# Altium schematic sheet UFP.SchDoc
size B; SheetNumber: 3; SheetTotal: 8
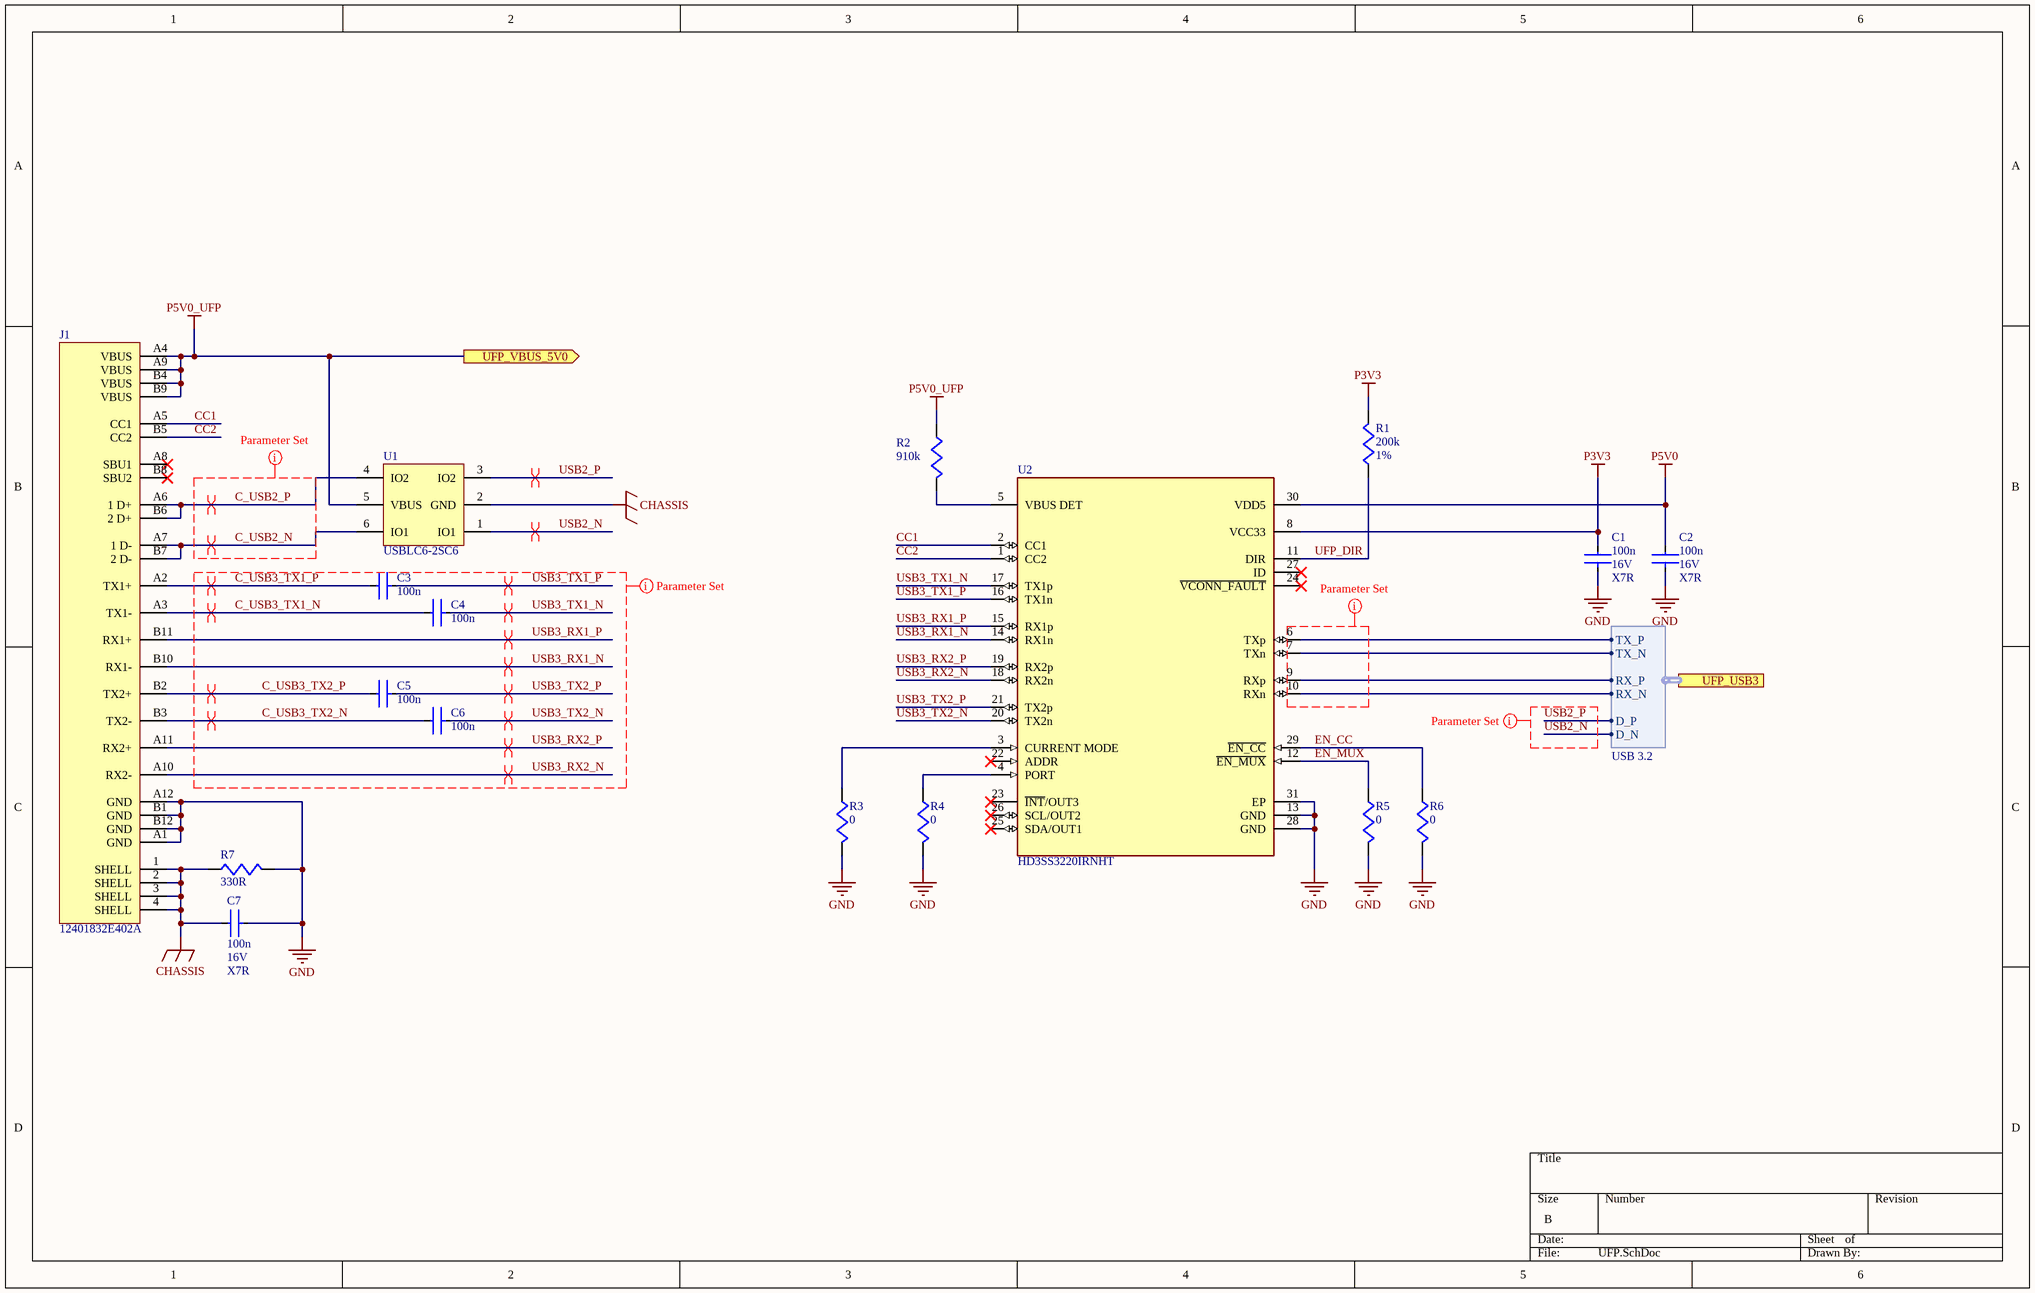
[diagram p0: UFP.SchDoc]

## Parts
C1  value 100n  Voltage: 16V  Dielectric: X7R  [CAPC1005X06N]  (hidden comment: 100nF 16V 0402)
C2  value 100n  Voltage: 16V  Dielectric: X7R  [CAPC1005X06N]  (hidden comment: 100nF 16V 0402)
C3  value 100n  [CAPC0603X03N]  (hidden comment: 100nF 10V 0201)
C4  value 100n  [CAPC0603X03N]  (hidden comment: 100nF 10V 0201)
C5  value 100n  [CAPC0603X03N]  (hidden comment: 100nF 10V 0201)
C6  value 100n  [CAPC0603X03N]  (hidden comment: 100nF 10V 0201)
C7  value 100n  Voltage: 16V  Dielectric: X7R  [CAPC1005X06N]  (hidden comment: 100nF 16V 0402)
J1  12401832E402A  [FP-12401832E402A-MFG]
R1  value 200k  Tolerance: 1%  [RESC1005X04M]  (hidden comment: 200k 1% 0402)
R2  value 910k  [RESC1005X04M]  (hidden comment: 910k 1% 0402)
R3  value 0  [RESC1508X05M]  (hidden comment: 0 Ohm 1% 0603)
R4  value 0  [RESC1508X05M]  (hidden comment: 0 Ohm 1% 0603)
R5  value 0  [RESC1508X05M]  (hidden comment: 0 Ohm 1% 0603)
R6  value 0  [RESC1508X05M]  (hidden comment: 0 Ohm 1% 0603)
R7  value 330R  [RESC1005X04M]  (hidden comment: 330R 1% 0402)
U1  USBLC6-2SC6  [SOT95P280X145-6N]
U2  HD3SS3220IRNHT  [FP-RNH0030A-MFG]

## Ports
UFP_USB3 (harness USB 3.2, see Main[1B], USB7206C[1D]), UFP_VBUS_5V0 (out, see Main[1B], USB7206C[1A])

## Harnesses
USB 3.2: D_N, D_P, TX_P, TX_N, RX_P, RX_N

## Nets
CHASSIS: C7.2 J1.1(SHELL) J1.2(SHELL) J1.3(SHELL) J1.4(SHELL) R7.1 U1.2(GND)
GND: C1.1 C2.1 C7.1 J1.A1(GND) J1.A12(GND) J1.B1(GND) J1.B12(GND) R3.2 R4.2 R5.2 R6.2 R7.2 U2.13(GND) U2.28(GND) U2.31(EP)
P3V3: C1.2 R1.2 U2.8(VCC33)
P5V0: C2.2 U2.30(VDD5)
P5V0_UFP: J1.A4(VBUS) J1.A9(VBUS) J1.B4(VBUS) J1.B9(VBUS) R2.1 U1.5(VBUS) ; port UFP_VBUS_5V0
C_USB2_N: J1.A7(1_D-) J1.B7(2_D-) U1.6(IO1)
C_USB2_P: J1.A6(1_D+) J1.B6(2_D+) U1.4(IO2)
C_USB3_TX1_N: C4.2 J1.A3(TX1-)
C_USB3_TX1_P: C3.2 J1.A2(TX1+)
C_USB3_TX2_N: C6.2 J1.B3(TX2-)
C_USB3_TX2_P: C5.2 J1.B2(TX2+)
CC1: J1.A5(CC1) U2.2(CC1)
CC2: J1.B5(CC2) U2.1(CC2)
EN_CC: R6.1 U2.29(~{EN_CC})
EN_MUX: R5.1 U2.12(~{EN_MUX})
UFP_DIR: R1.1 U2.11(DIR)
USB2_N: U1.1(IO1) ; port UFP_USB3.D_N
USB2_P: U1.3(IO2) ; port UFP_USB3.D_P
USB3_RX1_N: J1.B10(RX1-) U2.14(RX1n)
USB3_RX1_P: J1.B11(RX1+) U2.15(RX1p)
USB3_RX2_N: J1.A10(RX2-) U2.18(RX2n)
USB3_RX2_P: J1.A11(RX2+) U2.19(RX2p)
USB3_TX1_N: C4.1 U2.17(TX1p)
USB3_TX1_P: C3.1 U2.16(TX1n)
USB3_TX2_N: C6.1 U2.20(TX2n)
USB3_TX2_P: C5.1 U2.21(TX2p)
NetR2_2: R2.2 U2.5(VBUS_DET)
NetR3_1: R3.1 U2.3(CURRENT_MODE)
NetR4_1: R4.1 U2.4(PORT)
NetU2_6: U2.6(TXp) ; port UFP_USB3.TX_P
NetU2_7: U2.7(TXn) ; port UFP_USB3.TX_N
NetU2_9: U2.9(RXp) ; port UFP_USB3.RX_P
NetU2_10: U2.10(RXn) ; port UFP_USB3.RX_N

Not connected (* = marked no-connect by the designer): J1 A8(SBU1)* B8(SBU2)*; U2 22(ADDR)* 23(~{INT}/OUT3)* 24(~{VCONN_FAULT})* 25(SDA/OUT1)* 26(SCL/OUT2)* 27(ID)*

## Layout directives
differential pair; differential pair class DIFF90: C_USB2_N, C_USB2_P, C_USB3_TX1_N, C_USB3_TX1_P, C_USB3_TX2_N, C_USB3_TX2_P, USB2_N, USB2_P, USB3_RX1_N, USB3_RX1_P, USB3_RX2_N, USB3_RX2_P, USB3_TX1_N, USB3_TX1_P, USB3_TX2_N, USB3_TX2_P
net class USB2: C_USB2_N, C_USB2_P, USB2_N, USB2_P
net class USB3: (no net found under the mark), C_USB3_TX1_N, C_USB3_TX1_P, C_USB3_TX2_N, C_USB3_TX2_P, USB3_RX1_N, USB3_RX1_P, USB3_RX2_N, USB3_RX2_P, USB3_TX1_N, USB3_TX1_P, USB3_TX2_N, USB3_TX2_P

## Library data of the parts
C1 C2 = CMP-001-00088-1: 16V 100nF X7R ±10% 0402 Multilayer Ceramic Capacitors MLCC - SMD/SMT ROHS; LCSC Part #: C1525; Package: 0402
C3-C6 = CMP-001-00107-1: 10V 100nF X5R ±10% 0201 Multilayer Ceramic Capacitors MLCC - SMD/SMT ROHS; Voltage: 10V; Dielectric: X5R; Package: 0402; LCSC Part #: C76934
C7 = CMP-001-00088-2: 16V 100nF X7R ±10% 0402 Multilayer Ceramic Capacitors MLCC - SMD/SMT ROHS; LCSC Part #: C1525; Package: 0402
J1 = CMP-002-00130-1: Conn USB Type C RCP 24 POS 0.25mm Solder RA SMD 24 Terminal 1 Port T/R; LCSC Part #: C464604
R1 = CMP-009-00220-2: 62.5mW Thick Film Resistors 50V ±100ppm/℃ ±1% 200kΩ 0402 Chip Resistor - Surface Mount ROHS; Package: 0402; LCSC Part #: C114763
R2 = CMP-009-00225-1: 62.5mW Thick Film Resistors 50V ±100ppm/℃ ±1% 910kΩ 0402 Chip Resistor - Surface Mount ROHS; Tolerance: 1%; LCSC Part #: C137927; Package: 0402
R3-R6 = CMP-009-00190-2: 62.5mW Thick Film Resistors 50V 0Ω 0402 Chip Resistor - Surface Mount ROHS; Tolerance: 1%; Package: 0603; LCSC Part #: C60485
R7 = CMP-009-00201-3: 62.5mW Thick Film Resistors 50V ±100ppm/℃ ±1% 330Ω 0402 Chip Resistor - Surface Mount ROHS; Tolerance: 1%; LCSC Part #: C105875; Package: 0402
U1 = CMP-015-00019-2: Trans Voltage Suppressor Diode, 5V V(RWM), Unidirectional, 1 Element, Silicon; LCSC Part #: C7519
U2 = CMP-001-0008-5: 10-Gbps USB 3.1 Type-C 2: 1 mux with DRP Controller 30-WQFN -40 to 85; LCSC Part #: C165155